# Altium project Nano_PCB.PrjPcb
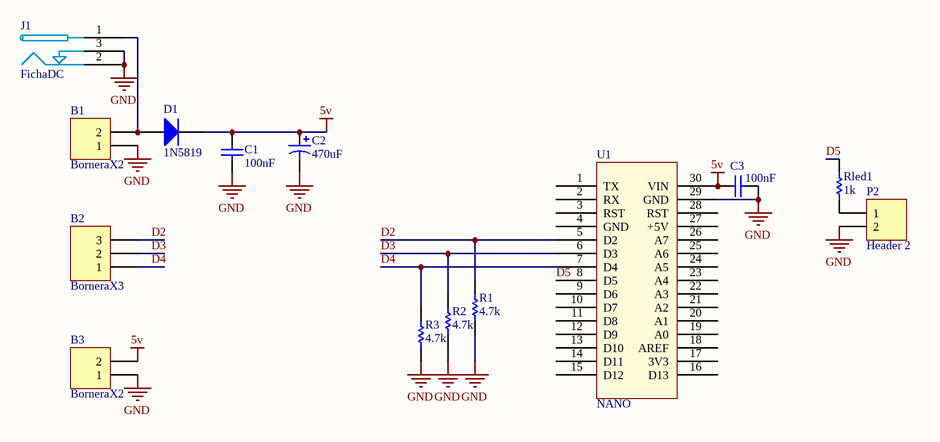
[diagram p0: Nano_PCB.SchDoc]
1 sheet, 14 parts. Net scope: global (net labels, ports and power ports of the same name join across sheets).
Board file: Nano_PCB.PcbDoc

## Sheet Nano_PCB.SchDoc
size A4

### Parts
B1  BorneraX2  [BORx2-5mm]
B2  BorneraX3  [BORx3-5mm]
B3  BorneraX2  [BORx2-5mm]
C1  100nF  [RAD-0.2]
C2  470uF  [RAD-10.5-5mm]
C3  100nF  [C_0805]
D1  1N5819  [DIODE-0.4]
J1  FichaDC  [FichaDC]
P2  Header 2  [HDR1X2]
R1  4.7k  [R_0805]
R2  4.7k  [R_0805]
R3  4.7k  [R_0805]
Rled1  1k  [R_0805]
U1  NANO  [NANO]

### Nets
5v: B3.2 C1.2 C2.1 C3.1 D1.2(K) U1.30(VIN)
GND: B1.1 B3.1 C1.1 C2.2 C3.2 J1.2 J1.3 P2.2 R1.1 R2.1 R3.1 U1.29(GND)
D2: B2.3 R1.2 U1.5(D2)
D3: B2.2 R2.2 U1.6(D3)
D4: B2.1 R3.2 U1.7(D4)
D5: Rled1.1 U1.8(D5)
NetB1_2: B1.2 D1.1(A) J1.1
NetP2_1: P2.1 Rled1.2

Not connected (* = marked no-connect by the designer): U1 1(TX) 2(RX) 3(RST) 4(GND) 9(D6) 10(D7) 11(D8) 12(D9) 13(D10) 14(D11) 15(D12) 16(D13) 17(3V3) 18(AREF) 19(A0) 20(A1) 21(A2) 22(A3) 23(A4) 24(A5) 25(A6) 26(A7) 27(+5V) 28(RST)

### Library data of the parts
C1 = Capacitor ceramico
C2 = Capacitor Elect.3 1000uF: Capacitor Electrolitico Polarizado
C3 = Capacitor_0805: 0805 Ceramic Chip Capacitor
D1 = 1N5819: 1A Low Drop Power Schottky Rectifier Diode
P2 = Header 2: Header, 2-Pin
R1-R3 Rled1 = Resistor_0805: 0805 1/8W Chip Resistor
U1 = NANO: Arduino Nano